# Altium schematic sheet 3. MCU.SchDoc
size A4
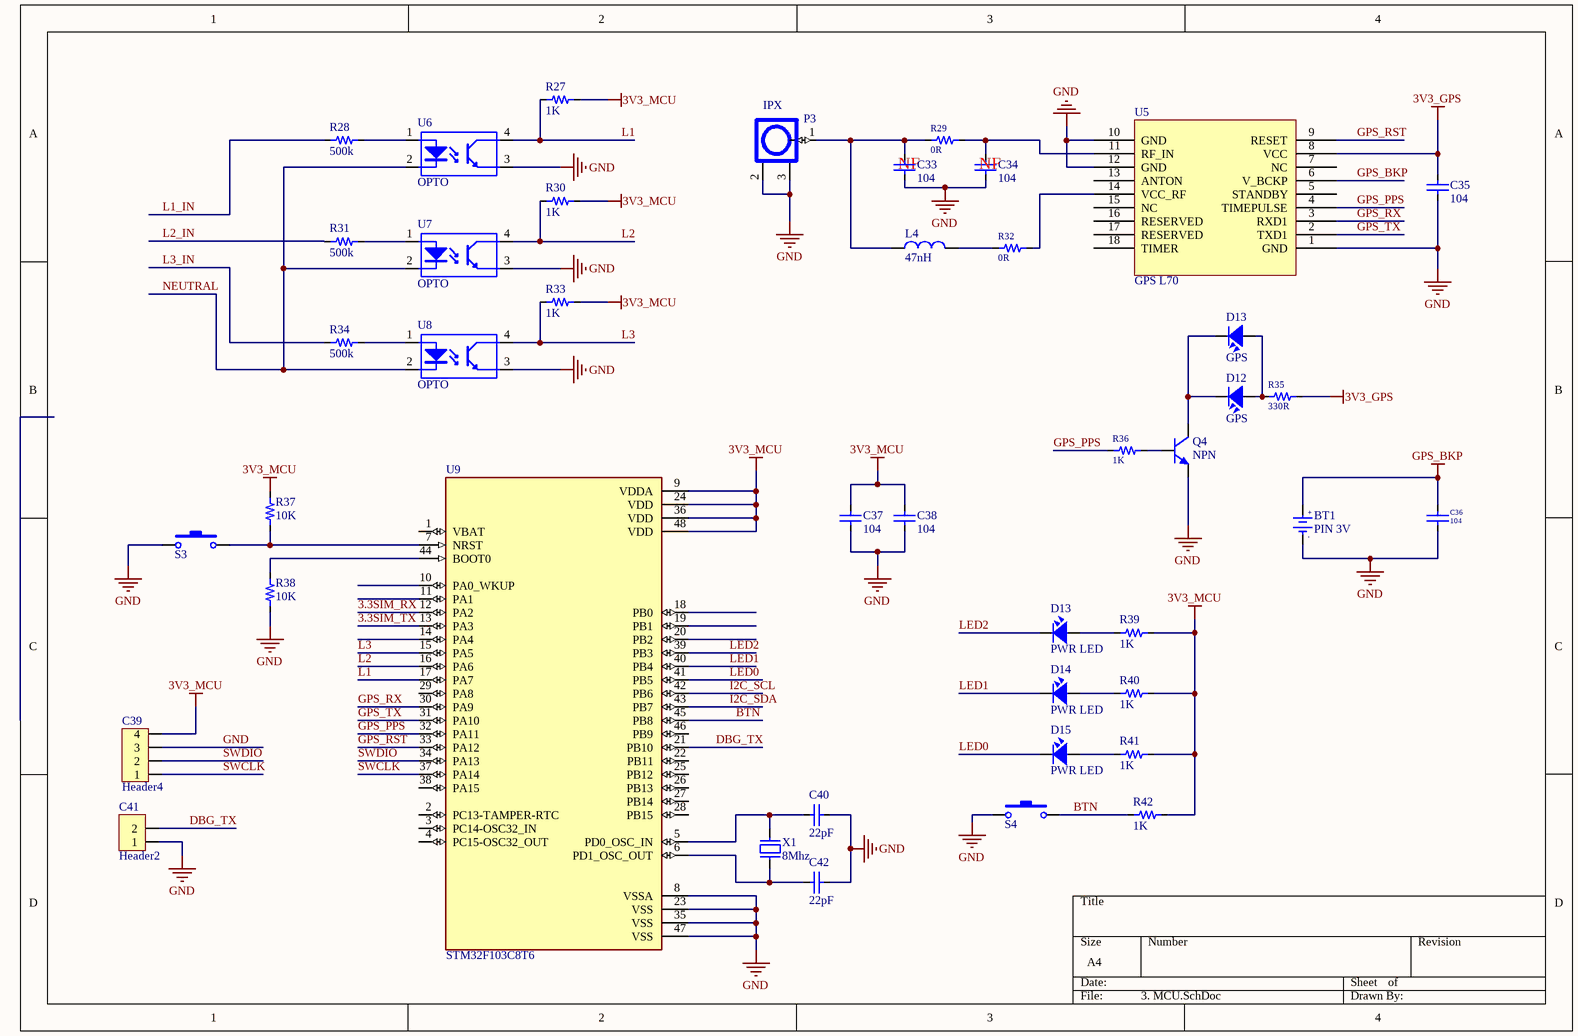
[diagram p0: 3. MCU.SchDoc]

## Parts
(Parts that share a designator on the sheet are numbered #1, #2 ... from top to bottom, then left to right.)
BT1  PIN 3V  [CR1220 SMD]
C33  104  [CAP_0603]
C34  104  [CAP_0603]
C35  104  [CAP_0603]
C36  104  [CAP_0603]
C37  104  [CAP_0603]
C38  104  [CAP_0603]
C39  Header4  [JP4]
C40  22pF  [CAP_0603]
C41  Header2  [JP2]
C42  22pF  [CAP_0603]
D12  GPS  [LED-0603-Red]
D13#1  GPS  [LED-3]
D13#2  PWR LED  [LED-3]
D14  PWR LED  [LED-3]
D15  PWR LED  [LED-3]
L4  47nH  [RES-SMD-0603]
P3  IPX  [IPXS]
Q4  NPN  [MMBT3904]
R27  1K  [RES-SMD-0603]
R28  500k  [RES-SMD-0603]
R29  0R  [RES-SMD-0603]
R30  1K  [RES-SMD-0603]
R31  500k  [RES-SMD-0603]
R32  0R  [RES-SMD-0603]
R33  1K  [RES-SMD-0603]
R34  500k  [RES-SMD-0603]
R35  330R  [RES-SMD-0603]
R36  1K  [RES-SMD-0603]
R37  10K  [RES-SMD-0603]
R38  10K  [RES-SMD-0603]
R39  1K  [RES-SMD-0603]
R40  1K  [RES-SMD-0603]
R41  1K  [RES-SMD-0603]
R42  1K  [RES-SMD-0603]
S3  SW-SMD  [SW-SMD]  (value not drawn)
S4  SW-SMD  [JP2]  (value not drawn)
U5  GPS L70  [GPS L70]
U6  OPTO  [OPTO_SMD]
U7  OPTO  [OPTO_SMD]
U8  OPTO  [OPTO_SMD]
U9  STM32F103C8T6  [STM32F103C8T6]
X1  8Mhz  [XTAL 5032 SMD 8Mhz]

## Nets
3V3_GPS: C35.2 R35.2 U5.8(VCC)
3V3_MCU: C37.2 C38.2 C39.4 R27.2 R30.2 R33.2 R37.2 R39.1 R40.1 R41.1 R42.1 U9.9(VDDA) U9.24(VDD) U9.36(VDD) U9.48(VDD)
GND: BT1.2(GND) C33.1 C34.1 C35.1 C36.1 C37.1 C38.1 C39.3 C40.2 C41.1 C42.2 P3.2 P3.3 Q4.2(E) R38.2 S3.1 S4.1 U5.1(GND) U5.10(GND) U5.12(GND) U6.3(E) U7.3(E) U8.3(E) U9.8(VSSA) U9.23(VSS) U9.35(VSS) U9.47(VSS)
GPS_BKP: BT1.1(+3V) C36.2 U5.6(V_BCKP)
3.3SIM_RX: U9.12(PA2)
3.3SIM_TX: U9.13(PA3)
BTN: R42.2 S4.2 U9.45(PB8)
DBG_TX: C41.2 U9.21(PB10)
GPS_PPS: R36.1 U5.4(TIMEPULSE) U9.32(PA11)
GPS_RST: U5.9(RESET) U9.33(PA12)
GPS_RX: U5.3(RXD1) U9.30(PA9)
GPS_TX: U5.2(TXD1) U9.31(PA10)
I2C_SCL: U9.42(PB6)
I2C_SDA: U9.43(PB7)
L1: R27.1 U6.4(C) U9.17(PA7)
L1_IN: R28.2
L2: R30.1 U7.4(C) U9.16(PA6)
L2_IN: R31.2
L3: R33.1 U8.4(C) U9.15(PA5)
L3_IN: R34.2
LED0: D15.2 U9.41(PB5)
LED1: D14.2 U9.40(PB4)
LED2: D13#2.2 U9.39(PB3)
NEUTRAL: U6.2(K) U7.2(K) U8.2(K)
SWCLK: C39.1 U9.37(PA14)
SWDIO: C39.2 U9.34(PA13)
NetC33_2: C33.2 L4.1 P3.1 R29.1
NetC34_2: C34.2 R29.2 U5.11(RF_IN)
NetC40_1: C40.1 U9.5(PD0_OSC_IN) X1.2
NetC42_1: C42.1 U9.6(PD1_OSC_OUT) X1.1
NetD12_1: D12.1 D13#1.1 R35.1
NetD12_2: D12.2 D13#1.2 Q4.3(C)
NetD13#2_1: D13#2.1 R39.2
NetD14_1: D14.1 R40.2
NetD15_1: D15.1 R41.2
NetL4_2: L4.2 R32.1
NetQ4_1: Q4.1(B) R36.2
NetR28_1: R28.1 U6.1(A)
NetR31_1: R31.1 U7.1(A)
NetR32_2: R32.2 U5.14(VCC_RF)
NetR34_1: R34.1 U8.1(A)
NetR37_1: R37.1 S3.2 U9.7(NRST)
NetR38_1: R38.1 U9.44(BOOT0)

Not connected (* = marked no-connect by the designer): U5 5(STANDBY) 7(NC) 13(ANTON) 15(NC) 16(RESERVED) 17(RESERVED) 18(TIMER); U9 1(VBAT) 2(PC13-TAMPER-RTC) 3(PC14-OSC32_IN) 4(PC15-OSC32_OUT) 10(PA0_WKUP) 11(PA1) 14(PA4) 18(PB0) 19(PB1) 20(PB2) 22(PB11) 25(PB12) 26(PB13) 27(PB14) 28(PB15) 29(PA8) 38(PA15) 46(PB9)

## Notes on the sheet
- (near C33) NF
- (near C34) NF
- (in symbol PIN 3V) +; -

## Library data of the parts
BT1 = PIN 3V: Battery 3VDC; Value: PIN 3V
C33-C38 C40 C42 = CapSMD: Capacitor; Value: 33p; Published: 8-Jun-2000; LatestRevisionDate: 17-Jul-2002; LatestRevisionNote: Re-released for DXP Platform.; PackageReference: RAD-0.3; Publisher: Altium Limited
C39 = Header4: Header IDC, 4 x 1 Pin Vertical 2.54mm Pitch (Non-Boxed, Male); Manufacturer: W¨¹rth Elektronik eiSos GmbH; partNo: 613002143121; ComponentLink1 Description: Manufacturer; ComponentLink2 Description: Datasheet; NoPins: 02; Created Date: 29 March 2013; ComponentLink1URL: http://www.we-online.com; ComponentLink2URL: http://katalog.we-online.de/em/datasheet/6130xx143121.pdf; Created by: Karrer Zheng
C41 = Header2: Header IDC, 2 x 1 Pin Vertical 2.54mm Pitch (Non-Boxed, Male); Manufacturer: W¨¹rth Elektronik eiSos GmbH; partNo: 613002143121; ComponentLink1 Description: Manufacturer; ComponentLink2 Description: Datasheet; NoPins: 02; Created Date: 29 March 2013; ComponentLink1URL: http://www.we-online.com; ComponentLink2URL: http://katalog.we-online.de/em/datasheet/6130xx143121.pdf; Created by: Karrer Zheng
D12 D13#1 D13#2 D14 D15 = LED: LED Single colour Green and Red; Value: LED 3 ly Single Colour
L4 = L1: Inductor; Value: 150 mH
P3 = IPXSx66: Antenna GSM GPS; Manufacturer: TE Connectivity AMP Connectors; Part number: 2334884-1; User_Description: UMCC MICRO-COAX RECEPTACLE, GEN; Category: Connectors; Package: SMD
Q4 = MMBT3904
R27-R42 = Resistor - SMD: Resistor; Manufacturer: Generic Components; Class: Passive; Published: 08/06/2000; Publisher: Altium Hobart Technology Centre
S3 S4 = SW-SMD: Switch; Published: 24-Mar-1999; LatestRevisionDate: 17-Jul-2002; LatestRevisionNote: Re-released for DXP Platform.; PackageReference: SPST-2; Publisher: Altium Limited
U6-U8 = OPTO: Single Opto; Value: TLP5211
U9 = STM32F103C8T6: Mainstream Performance line, ARM Cortex-M3 MCU with 64 Kbytes Flash, 72 MHz CPU, motor control, USB and CAN
X1 = XT2: Crystal For all Crystal 2pin.; Value: 4Mhz